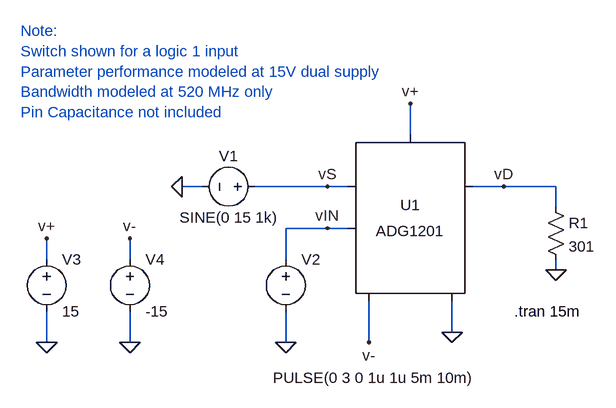
[diagram p0: schematic ADG1201.asc]
ADG1201.asc, the LTspice schematic file:
Version 4.1
SHEET 1 936 832
WIRE 240 144 240 96
WIRE -80 224 -112 224
WIRE 112 224 0 224
WIRE 144 224 112 224
WIRE 384 224 336 224
WIRE 464 224 384 224
WIRE 464 256 464 224
WIRE 112 288 48 288
WIRE 144 288 112 288
WIRE -320 336 -320 304
WIRE -192 336 -192 304
WIRE 48 336 48 288
WIRE 464 352 464 336
WIRE 304 448 304 400
WIRE -320 464 -320 416
WIRE -192 464 -192 416
WIRE 48 464 48 416
WIRE 176 464 176 400
FLAG -112 224 0
FLAG 48 464 0
FLAG 464 352 0
FLAG 304 448 0
FLAG 384 224 vD
FLAG 112 224 vS
FLAG 112 288 vIN
FLAG -192 304 v-
FLAG 240 96 v+
FLAG -192 464 0
FLAG 176 464 v-
FLAG -320 304 v+
FLAG -320 464 0
SYMBOL voltage 16 224 M270
WINDOW 0 32 56 VTop 2
WINDOW 3 -32 56 VBottom 2
WINDOW 123 0 0 Left 0
WINDOW 39 0 0 Left 0
SYMATTR InstName V1
SYMATTR Value SINE(0 15 1k)
SYMBOL res 448 240 R0
SYMATTR InstName R1
SYMATTR Value 301
SYMBOL voltage 48 320 R0
WINDOW 123 0 0 Left 0
WINDOW 39 0 0 Left 0
WINDOW 3 -20 198 Left 2
SYMATTR Value PULSE(0 3 0 1u 1u 5m 10m)
SYMATTR InstName V2
SYMBOL voltage -192 320 R0
WINDOW 123 0 0 Left 0
WINDOW 39 0 0 Left 0
SYMATTR InstName V4
SYMATTR Value -15
SYMBOL voltage -320 320 R0
WINDOW 123 0 0 Left 0
WINDOW 39 0 0 Left 0
SYMATTR InstName V3
SYMATTR Value 15
SYMBOL ADG1201 240 272 R0
SYMATTR InstName U1
TEXT 400 416 Left 2 !.tran 15m
TEXT -360 -16 Left 2 ;Note:\nSwitch shown for a logic 1 input\nParameter performance modeled at 15V dual supply\nBandwidth modeled at 520 MHz only\nPin Capacitance not included

The netlist it stands for:
* ADG1201.asc
V1 vS 0 SINE(0 15 1k)
R1 vD 0 301
V2 vIN 0 PULSE(0 3 0 1u 1u 5m 10m)
V4 v- 0 -15
V3 v+ 0 15
X§U1 vIN vD vS v- 0 v+ ADG1201
.tran 15m
* Note:
* Switch shown for a logic 1 input
* Parameter performance modeled at 15V dual supply
* Bandwidth modeled at 520 MHz only
* Pin Capacitance not included
.lib ADG1201.sub
.backanno
.end